# EAGLE design fixed (EAGLE 9.5.2)
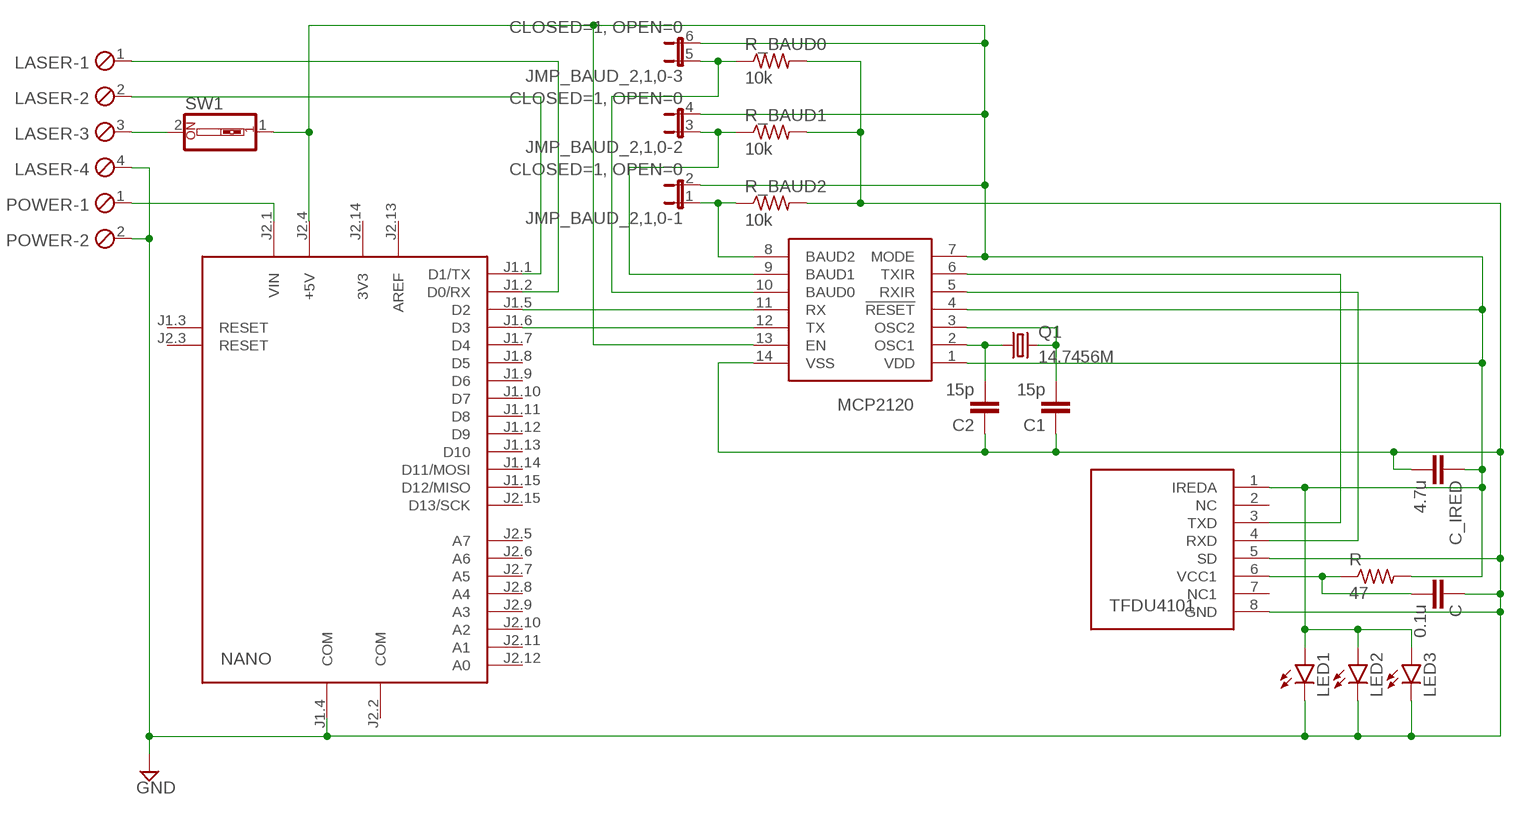
[diagram p0: schematic, sheet 1]

## Parts
C  0.1u  C-EUC1206  [C1206]
C1  15p  C-EUC1206  [C1206]
C2  15p  C-EUC1206  [C1206]
C_IRED  4.7u  C-EUC1206  [C1206]
JMP_BAUD_2,1,0  CLOSED=1, OPEN=0  JP3QE  [JP3Q]
LASER  MPT4  [4POL254]
LED1  LED5MM  [LED5MM]
LED2  LED5MM  [LED5MM]
LED3  LED5MM  [LED5MM]
MCP2120  MCP2120_SOIC  [SO14]
NANO  ARDUINO_NANO2  [ARDUINO_NANO2]
POWER  MPT2  [2POL254]
Q1  14.7456M  CRYSTALTC26V  [TC26V]
R  47  R-US_R1206W  [R1206W]
R_BAUD0  10k  R-US_R1206W  [R1206W]
R_BAUD1  10k  R-US_R1206W  [R1206W]
R_BAUD2  10k  R-US_R1206W  [R1206W]
SW1  SW_DIP-1  [EDG-01]
TFDU4101  TFDU4101_TOP  [TFDU4101_TOP]

## Nets
GND: C1.1 C2.1 C.1 C_IRED.2 LASER.4 LED1.K(C) LED2.K(C) LED3.K(C) MCP2120.14(VSS) NANO.J1.4(COM) POWER.2 R_BAUD0.2 R_BAUD1.2 R_BAUD2.2 TFDU4101.5(SD) TFDU4101.8(GND)
N$1: MCP2120.11(RX) NANO.J1.5(D2)
N$2: C2.2 MCP2120.2(OSC1) Q1.1
N$3: C_IRED.1 JMP_BAUD_2,1,0.2 JMP_BAUD_2,1,0.4 JMP_BAUD_2,1,0.6 LED1.A LED2.A LED3.A MCP2120.1(VDD) MCP2120.4(!RESET) MCP2120.7(MODE) MCP2120.13(EN) NANO.J2.4(+5V) R.2 SW1.1 TFDU4101.1(IREDA)
N$4: MCP2120.12(TX) NANO.J1.6(D3)
N$5: JMP_BAUD_2,1,0.5 MCP2120.10(BAUD0) R_BAUD0.1
N$6: JMP_BAUD_2,1,0.3 MCP2120.9(BAUD1) R_BAUD1.1
N$7: JMP_BAUD_2,1,0.1 MCP2120.8(BAUD2) R_BAUD2.1
N$8: LASER.3 SW1.2
N$9: C1.2 MCP2120.3(OSC2) Q1.2
N$10: MCP2120.6(TXIR) TFDU4101.3(TXD)
N$11: MCP2120.5(RXIR) TFDU4101.4(RXD)
N$12: LASER.2 NANO.J1.1(D1/TX)
N$13: NANO.J2.1(VIN) POWER.1
N$14: C.2 R.1 TFDU4101.6(VCC1)
N$15: LASER.1 NANO.J1.2(D0/RX)
Unconnected: NANO.J1.3(RESET) NANO.J1.7(D4) NANO.J1.8(D5) NANO.J1.9(D6) NANO.J1.10(D7) NANO.J1.11(D8) NANO.J1.12(D9) NANO.J1.13(D10) NANO.J1.14(D11/MOSI) NANO.J1.15(D12/MISO) NANO.J2.3(RESET) NANO.J2.5(A7) NANO.J2.6(A6) NANO.J2.7(A5) NANO.J2.8(A4) NANO.J2.9(A3) NANO.J2.10(A2) NANO.J2.11(A1) NANO.J2.12(A0) NANO.J2.15(D13/SCK) TFDU4101.2(NC) TFDU4101.7(NC1)

## Power pins joined to a net without a drawn wire
3V3: NANO.J2.14(3V3)
AREF: NANO.J2.13(AREF)
COM: NANO.J2.2(COM)

## Library data of the parts
C C1 C2 C_IRED = rcl:C-EU: CAPACITOR, European symbol; SPICEPREFIX: C
JMP_BAUD_2,1,0 = jumper:JP3QE: JUMPER
LASER = con-phoenix-254_modified:MPT4: PHOENIX CONNECTOR; OC_FARNELL: unknown; OC_NEWARK: unknown
LED1-LED3 = led:LED: LED OSRAM: - CHIPLED LG R971, LG N971, LY N971, LG Q971, LY Q971, LO R971, LY R971 LH N974, LH R974 LS Q976, LO Q976, LY Q976 LO Q996 - Hyper CHIPLED LW Q18S LB Q993, LB Q99A, LB R99A - SideLED LS A670, LO A670, LY A670, LG A670, LP A670 LB A673, LV A673, LT A673, LW A673 LH A674 LY A675 LS A676, LA A676, LO A676, LY A676, LW A676 LS A679, LY A679, LG A679 - Hyper Micro SIDELED® LS Y876, LA Y876, LO Y876, LY Y876 LT Y87S - SmartLED LW L88C, LW L88S LB L89C, LB L89S, LG L890 LS L89K, LO L89K, LY L89K LS L896, LA L896, LO L896, LY L896 - TOPLED LS T670, LO T670, LY T670, LG T670, LP T670 LSG T670, LSP T670, LSY T670, LOP T670, LYG T670 LG T671, LOG T671, LSG T671 LB T673, LV T673, LT T673, LW T673 LH T674 LS T676, LA T676, LO T676, LY T676, LB T676, LH T676, LSB T676, LW T676 LB T67C, LV T67C, LT T67C, LS T67K, LO T67K, LY T67K, LW E67C LS E67B, LA E67B, LO E67B, LY E67B, LB E67C, LV E67C, LT E67C LW T67C LS T679, LY T679, LG T679 LS T770, LO T770, LY T770, LG T770, LP T770 LB T773, LV T773, LT T773, LW T773 LH T774 LS E675, LA E675, LY E675, LS T675 LS T776, LA T776, LO T776, LY T776, LB T776 LHGB T686 LT T68C, LB T68C - Hyper Mini TOPLED® LB M676 - Mini TOPLED Santana® LG M470 LS M47K, LO M47K, LY M47K Source: http://www.osram.convergy.de LUXEON: - LUMILED® LXK2-PW12-R00, LXK2-PW12-S00, LXK2-PW14-U00, LXK2-PW14-V00 LXK2-PM12-R00, LXK2-PM12-S00, LXK2-PM14-U00 LXK2-PE12-Q00, LXK2-PE12-R00, LXK2-PE12-S00, LXK2-PE14-T00, LXK2-PE14-U00 LXK2-PB12-K00, LXK2-PB12-L00, LXK2-PB12-M00, LXK2-PB14-N00, LXK2-PB14-P00, LXK2-PB14-Q00 LXK2-PR12-L00, LXK2-PR12-M00, LXK2-PR14-Q00, LXK2-PR14-R00 LXK2-PD12-Q00, LXK2-PD12-R00, LXK2-PD12-S00 LXK2-PH12-R00, LXK2-PH12-S00 LXK2-PL12-P00, LXK2-PL12-Q00, LXK2-PL12-R00 Source: www.luxeon.com KINGBRIGHT: KA-3528ASYC Source: www.kingbright.com
MCP2120 = IrDA_transceiver:MCP2120_SOIC
NANO = arduino:ARDUINO_NANO2: Arduino Nano2 Auto generated by modulcreator.ulp \;; ANZAHL: 2; MODUL: TRUE; STECKX0: -76200; STECKX1: 76200; STECKY0: 177800; STECKY1: 177800
POWER = con-phoenix-254_modified:MPT2: PHOENIX CONNECTOR; OC_FARNELL: unknown; OC_NEWARK: unknown
Q1 = crystal:CRYSTAL: CRYSTAL; OC_FARNELL: unknown; OC_NEWARK: unknown
R R_BAUD0 R_BAUD1 R_BAUD2 = rcl:R-US_: RESISTOR, American symbol; SPICEPREFIX: R
SW1 = special_modified:SW_DIP-1: DIP SWITCH
TFDU4101 = IrDA_transceiver:TFDU4101_TOP

## Board
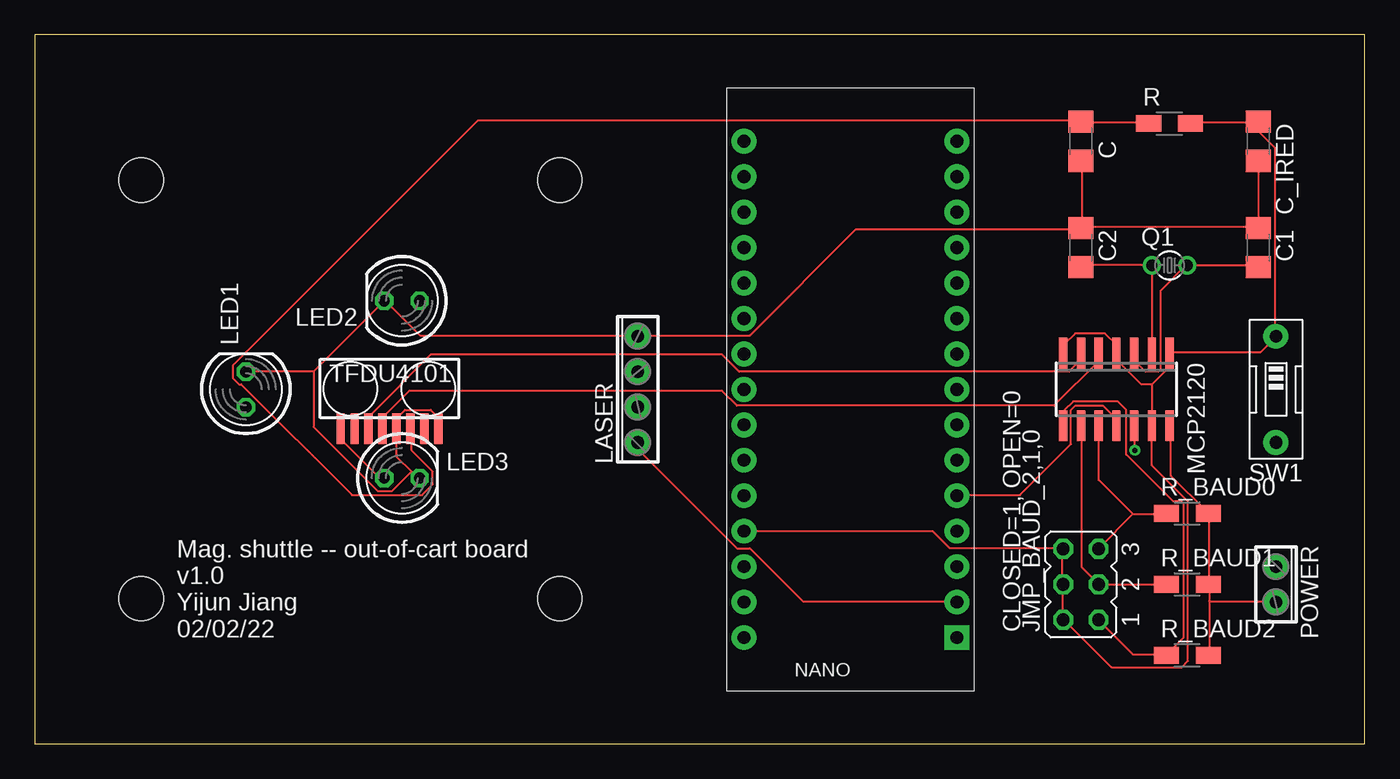
[diagram p1: board, top side]
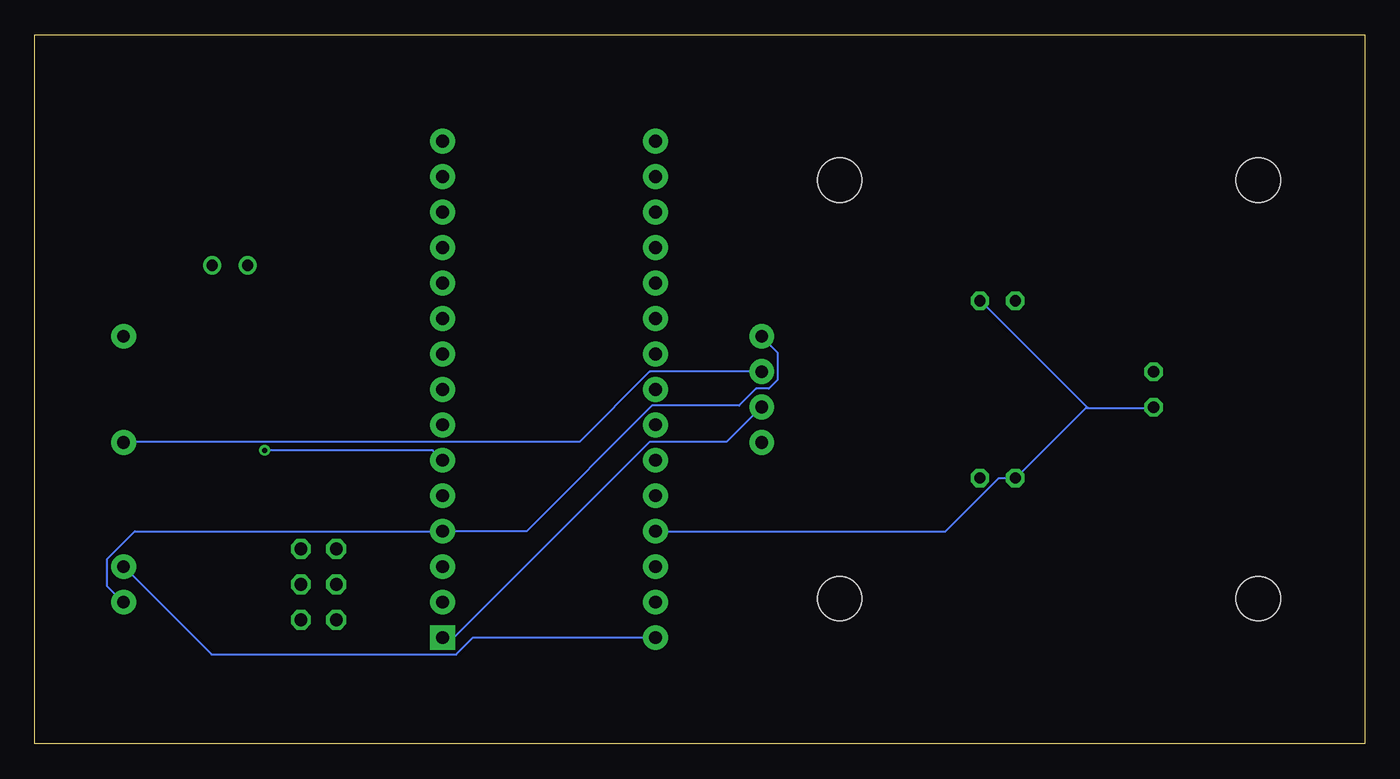
[diagram p2: board, bottom side, seen from below]

Size 95.25 x 50.8 mm. Coordinates in mm from the lower left corner, seen from the top.
Outline: 0,0 95.25,0 95.25,50.8 0,50.8 0,0
Copper layers (1*16): Top 0.035mm / dielectric 1.5mm / Bottom 0.035mm
Design rules "default": minimum track width 6mil, minimum drill 0.35mm, track to track 6mil, track to pad 6mil, pad to pad 6mil, via to via 6mil, smd to smd 6mil, copper to edge 40mil, drill to drill 6mil, minimum pad ring 10mil, minimum via ring 8mil, stop-mask expansion 4mil, vias tented up to drill 0mil, thermal gap 10mil
Holes 3.17 mm at 7.62,40.39 37.59,40.39 7.62,10.41 37.59,10.41

### Footprints (pad centres in the part's own frame; a part is rotated, then mirrored left to right if it is on the bottom)
C1206 = smd 1.6 x 1.8: 1 -1.4,0; 2 1.4,0
JP3Q = drill 0.914 octagon: 1 -2.54,-1.27; 2 -2.54,1.27; 3 0,-1.27; 4 0,1.27; 5 2.54,-1.27; 6 2.54,1.27
4POL254 = drill 0.914 pad 1.778: 1 -3.81,0; 2 -1.27,0; 3 1.27,0; 4 3.81,0
LED5MM = drill 0.813 octagon: A -1.27,0; K 1.27,0
SO14 = smd 0.6 x 2.2: 1 -3.81,-2.6; 2 -2.54,-2.6; 3 -1.27,-2.6; 4 0,-2.6; 5 1.27,-2.6; 6 2.54,-2.6; 7 3.81,-2.6; 8 3.81,2.6; 9 2.54,2.6; 10 1.27,2.6; 11 0,2.6; 12 -1.27,2.6; 13 -2.54,2.6; 14 -3.81,2.6
ARDUINO_NANO2 = drill 0.914 pad 1.778 square: J1.1 -7.62,17.78 | drill 0.914 pad 1.778: J1.2 -7.62,15.24; J1.3 -7.62,12.7; J1.4 -7.62,10.16; J1.5 -7.62,7.62; J1.6 -7.62,5.08; J1.7 -7.62,2.54; J1.8 -7.62,0; J1.9 -7.62,-2.54; J1.10 -7.62,-5.08; J1.11 -7.62,-7.62; J1.12 -7.62,-10.16; J1.13 -7.62,-12.7; J1.14 -7.62,-15.24; J1.15 -7.62,-17.78; J2.1 7.62,17.78; J2.2 7.62,15.24; J2.3 7.62,12.7; J2.4 7.62,10.16; J2.5 7.62,7.62; J2.6 7.62,5.08; J2.7 7.62,2.54; J2.8 7.62,0; J2.9 7.62,-2.54; J2.10 7.62,-5.08; J2.11 7.62,-7.62; J2.12 7.62,-10.16; J2.13 7.62,-12.7; J2.14 7.62,-15.24; J2.15 7.62,-17.78
2POL254 = drill 0.914 pad 1.778: 1 -1.27,0; 2 1.27,0
TC26V = drill 0.813: 1 -1.27,0; 2 1.27,0
R1206W = smd 1.8 x 1.2: 1 -1.499,0; 2 1.499,0
EDG-01 = drill 0.914 pad 1.778: 1 0,-3.81; 2 0,3.81
TFDU4101_TOP = smd 0.6 x 2.2: 1 1.453,-0.79; 2 2.453,-0.79; 3 3.453,-0.79; 4 4.453,-0.79; 5 5.453,-0.79; 6 6.453,-0.79; 7 7.453,-0.79; 8 8.453,-0.79

### Placement (x,y rotation side)
C  74.93,43.18 90 top
C1  87.63,35.56 270 top
C2  74.93,35.56 270 top
C_IRED  87.63,43.18 270 top
JMP_BAUD_2,1,0  74.93,11.43 90 top
LASER  43.18,25.4 90 top
LED1  15.11,25.4 90 top
LED2  26.29,31.75 180 top
LED3  26.29,19.05 0 top
MCP2120  77.47,25.4 180 top
NANO  58.42,25.4 180 top
POWER  88.9,11.43 270 top
Q1  81.28,34.29 0 top
R  81.28,44.45 0 top
R_BAUD0  82.55,16.51 0 top
R_BAUD1  82.55,11.43 0 top
R_BAUD2  82.55,6.35 0 top
SW1  88.9,25.4 180 top
TFDU4101  20.45,23.37 0 top

### Tracks (layer width: path | path; a pad name or v marks a point on that pad's centre or on a via)
GND
  Top 0.152: 84.12,11.43 84.12,10.21 | 84.12,10.21 84.12,6.4 R_BAUD2.2 | 84.12,11.43 84.12,16.46 R_BAUD0.2 83.97,16.61 81.38,19.2 81.38,22.71 MCP2120.14 | 84.12,11.43 R_BAUD1.2 | 84.12,10.21 88.85,10.21 POWER.2 | 74.98,37.03 74.98,41.76 C.1 | C_IRED.2 87.63,37.03 | 87.63,37.03 74.98,37.03 | 74.98,37.03 C2.1 74.83,36.88 58.83,36.88 51.21,29.26 43.28,29.26 LASER.4 43.13,29.26 27.58,29.26 25.15,31.7 LED2.K 24.99,31.7 19.96,26.67 | 87.63,37.03 C1.1 | 26.98,19.51 27.43,19.05 LED3.K | 26.98,19.51 25.91,20.57 25.91,22.55 TFDU4101.5 25.91,22.71 25.91,23.32 26.52,23.93 28.35,23.93 28.8,23.47 28.8,22.71 TFDU4101.8 | 19.96,26.67 LED1.K | 26.98,19.51 25.6,18.14 24.54,18.14 19.96,22.71 19.96,26.67
  Bottom 0.152: POWER.2 89,10.21 90.07,11.28 90.07,13.26 88.09,15.24 NANO.J1.4 60.05,15.24 51.05,24.23 44.81,24.23 43.59,25.45 42.67,25.45 42.06,26.06 42.06,28.04 43.13,29.11 LASER.4
N$1
  Top 0.152: MCP2120.11 77.42,22.86 77.42,23.32 76.5,24.23 74.52,24.23 74.22,23.93 74.22,21.49 70.56,17.83 66.14,17.83 NANO.J1.5
N$2
  Top 0.152: C2.2 74.98,34.29 Q1.1 MCP2120.2
N$3
  Top 0.152: MCP2120.7 73.76,28.04 73.76,28.65 74.52,29.41 76.66,29.41 77.42,28.65 77.42,28.04 MCP2120.4 77.57,27.89 77.57,27.43 79.25,25.76 80.01,25.76 | 80.01,25.76 MCP2120.13 80.01,19.96 82.6,17.37 82.6,5.94 82.14,5.49 77.11,5.49 73.76,8.84 JMP_BAUD_2,1,0.2 73.61,8.99 73.61,11.43 | 80.01,25.76 81.23,26.98 81.23,27.89 MCP2120.1 81.38,28.04 87.78,28.04 88.85,29.11 SW1.1 88.85,29.26 88.85,42.67 87.63,43.89 87.63,44.5 | 87.63,44.5 82.91,44.5 R.2 | 87.63,44.5 C_IRED.1 | LED3.A 24.69,19.05 21.95,21.79 21.95,22.55 TFDU4101.1 | 73.61,11.43 73.61,13.87 JMP_BAUD_2,1,0.6 73.61,14.02 65.53,14.02 64.31,15.24 NANO.J2.4 | 73.61,11.43 JMP_BAUD_2,1,0.4
  Bottom 0.152: 19.81,24.08 19.96,24.08 24.99,19.05 LED3.A 26.21,19.05 30.02,15.24 NANO.J2.4 | 19.81,24.08 15.24,24.08 LED1.A | 19.81,24.08 27.43,31.7 LED2.A
N$4  (via drill 0.35)
  Top 0.152: v78.79,21.03 78.79,22.71 MCP2120.12
  Bottom 0.152: v78.79,21.03 66.75,21.03 NANO.J1.6
N$5
  Top 0.152: 78.64,16.46 80.92,16.46 R_BAUD0.1 | 78.64,16.46 76.2,14.02 JMP_BAUD_2,1,0.5 | MCP2120.10 76.2,18.9 78.64,16.46
N$6
  Top 0.152: R_BAUD1.1 JMP_BAUD_2,1,0.3 74.98,12.65 74.98,22.71 MCP2120.9
N$7
  Top 0.152: JMP_BAUD_2,1,0.1 76.2,8.84 78.64,6.4 80.92,6.4 R_BAUD2.1 81.08,6.4 82.3,7.62 82.3,17.22 82.14,17.37 81.53,17.37 78.18,20.73 78.18,23.93 77.57,24.54 74.37,24.54 73.76,23.93 73.76,22.86 MCP2120.8
N$8
  Bottom 0.152: LASER.3 51.21,26.67 56.24,21.64 88.85,21.64 SW1.2
N$9
  Top 0.152: C1.2 87.63,34.29 Q1.2 82.45,34.29 80.62,32.46 80.62,26.82 80.47,26.67 79.55,26.67 78.79,27.43 78.79,27.89 MCP2120.3
N$10
  Top 0.152: TFDU4101.3 23.93,22.71 23.93,23.47 28.35,27.89 49.23,27.89 50.44,26.67 74.07,26.67 74.83,27.43 74.83,27.89 MCP2120.6
N$11
  Top 0.152: MCP2120.5 76.2,27.43 73,24.23 50.29,24.23 49.23,25.3 26.82,25.3 24.99,23.47 24.99,22.71 TFDU4101.4
N$12
  Bottom 0.152: NANO.J1.1 65.23,7.62 51.21,21.64 45.72,21.64 43.28,24.08 LASER.2
N$13
  Bottom 0.152: NANO.J2.1 63.86,7.62 65.08,6.4 82.6,6.4 POWER.1
N$14
  Top 0.152: R.1 79.7,44.5 74.98,44.5 C.2 74.83,44.65 31.7,44.65 14.17,27.13 14.17,26.21 14.63,25.76 14.78,25.76 22.71,17.83 27.74,17.83 28.5,18.59 28.5,19.51 26.98,21.03 26.98,22.55 TFDU4101.6
N$15
  Top 0.152: NANO.J1.2 65.99,10.21 55.02,10.21 51.21,14.02 50.29,14.02 43.28,21.03 43.28,21.49 LASER.1

### Text on the board
tNames: Mag. shuttle -- out-of-cart board / v1.0 / Yijun Jiang / 02/02/22